# Altium schematic sheet DAC.SchDoc: DACs
size Letter; PageSetup: Record=PageOptions|CenterHorizontal=True|CenterVertical=True|PrintScale=0.75|XCorrection=1.00|YCorrection=1.00|PrintKind=1|BorderSize=5000000|LeftOffset=0|BottomOffset=0|Orientation=2|PaperLength=1000|PaperWidth=1000|Scale=100|PaperSource=7|PrintQuality=-4|MediaType=1|DitherType=10|PaperKind=Letter|PrintScaleMode=1; Author: Adam Gilbert; CompanyName: McGill University; DrawnBy: Adam Gilbert; Organization: Altium Limited; Address1: McGill Cosmology; Address2: 3600 University Street; Address3: Montreal, Quebec; Address4: Canada; Revision: Rev0; ProjectName: Dan DfMux Mezz
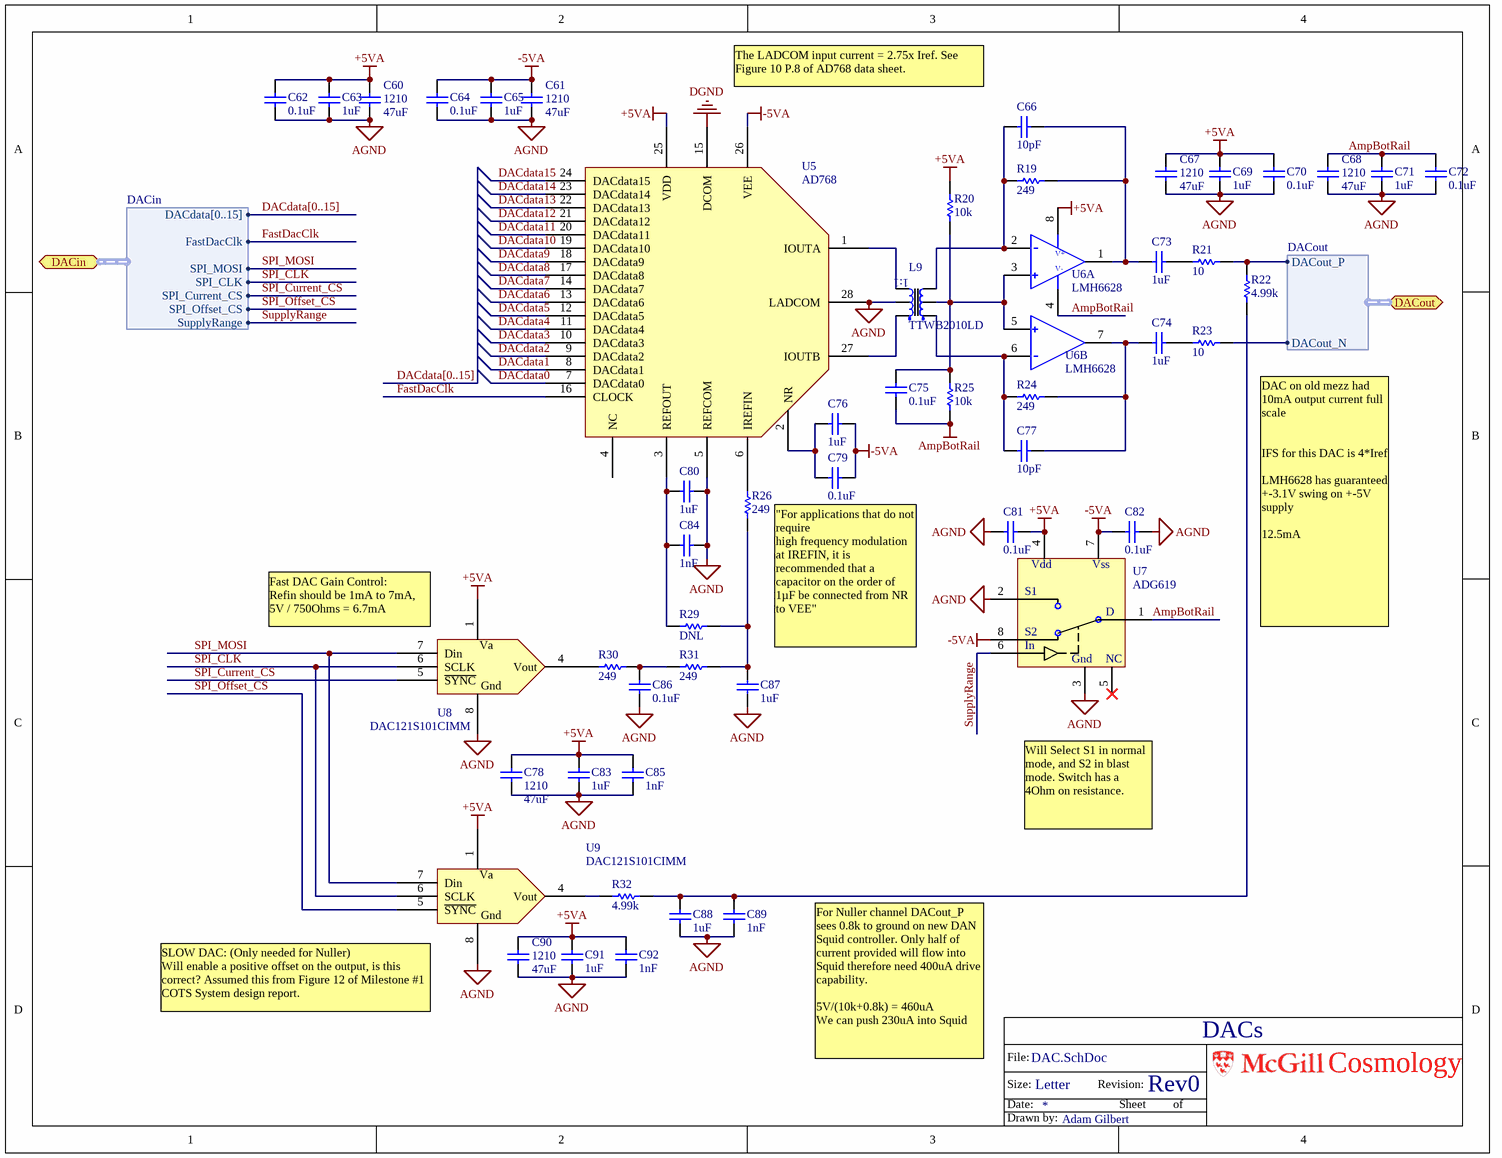
[diagram p0: DAC.SchDoc]

## Parts
C60  Footprint: 1210  [CC3225-1210]  (hidden comment: 47uF)
C61  Footprint: 1210  [CC3225-1210]  (hidden comment: 47uF)
C62  0.1uF  [0603]
C63  1uF  [0603]
C64  0.1uF  [0603]
C65  1uF  [0603]
C66  10pF  [0603]
C67  Footprint: 1210  [CC3225-1210]  (hidden comment: 47uF)
C68  Footprint: 1210  [CC3225-1210]  (hidden comment: 47uF)
C69  1uF  [0603]
C70  0.1uF  [0603]
C71  1uF  [0603]
C72  0.1uF  [0603]
C73  1uF  [0603]
C74  1uF  [0603]
C75  0.1uF  [0603]
C76  1uF  [0603]
C77  10pF  [0603]
C78  Footprint: 1210  [CC3225-1210]  (hidden comment: 47uF)
C79  0.1uF  [0603]
C80  1uF  [0603]
C81  0.1uF  [0603]
C82  0.1uF  [0603]
C83  1uF  [0603]
C84  1nF  [0603]
C85  1nF  [0603]
C86  0.1uF  [0603]
C87  1uF  [0603]
C88  1uF  [0603]
C89  1nF  [0603]
C90  Footprint: 1210  [CC3225-1210]  (hidden comment: 47uF)
C91  1uF  [0603]
C92  1nF  [0603]
L9  TTWB2010LD  [TTWB]
R19  249  [0603]
R20  10k  [0603]
R21  10  [0603]
R22  4.99k  [0603]
R23  10  [0603]
R24  249  [0603]
R25  10k  [0603]
R26  249  [0603]
R29  DNL  [0603]
R30  249  [0603]
R31  249  [0603]
R32  4.99k  [0603]
U5  AD768  [SOIC 28 300mils]
U6  LMH6628  [SO8]  (parts A,B of 2)
U7  ADG619  [SOT23-8]
U8  DAC121S101CIMM  [MSOP-8]
U9  DAC121S101CIMM  [MSOP-8]

## Ports
DACin (harness DACin), DACout (harness DACout)

## Harnesses
DACin: DACdata[0..15], FastDacClk, SPI_MOSI, SPI_CLK, SPI_Current_CS, SPI_Offset_CS, SupplyRange
DACout: DACout_P, DACout_N

## Nets
+5VA: C60.2 C62.2 C63.2 C67.2 C69.1 C70.1 C78.1 C81.1 C83.1 C85.1 C90.2 C91.2 C92.2 R20.2 U5.25(VDD) U6.8(V+) U7.4(Vdd) U8.1(Va) U9.1(Va)
-5VA: C61.2 C64.2 C65.2 C76.1 C79.1 C82.2 U5.26(VEE) U7.7(Vss) U7.8(S2)
AGND: C60.1 C61.1 C62.1 C63.1 C64.1 C65.1 C67.1 C68.1 C69.2 C70.2 C71.2 C72.2 C78.2 C80.2 C81.2 C82.1 C83.2 C84.2 C85.2 C86.2 C87.2 C88.1 C89.1 C90.1 C91.1 C92.1 L9.2(PrimCent) U5.5(REFCOM) U5.28(LADCOM) U7.2(S1) U7.3(Gnd) U8.8(Gnd) U9.8(Gnd)
AmpBotRail: C68.2 C71.1 C72.1 C75.2 R25.1 U6.4(V-) U7.1(D)
DGND: U5.15(DCOM)
DACdata0: U5.7(DACdata0)
DACdata1: U5.8(DACdata1)
DACdata2: U5.9(DACdata2)
DACdata3: U5.10(DACdata3)
DACdata4: U5.11(DACdata4)
DACdata5: U5.12(DACdata5)
DACdata6: U5.13(DACdata6)
DACdata7: U5.14(DACdata7)
DACdata8: U5.17(DACdata8)
DACdata9: U5.18(DACdata9)
DACdata10: U5.19(DACdata10)
DACdata11: U5.20(DACdata11)
DACdata12: U5.21(DACdata12)
DACdata13: U5.22(DACdata13)
DACdata14: U5.23(DACdata14)
DACdata15: U5.24(DACdata15)
FastDacClk: U5.16(CLOCK) ; port DACin.FastDacClk
SPI_CLK: U8.6(SCLK) U9.6(SCLK) ; port DACin.SPI_CLK
SPI_Current_CS: U8.5(~{SYNC}) ; port DACin.SPI_Current_CS
SPI_MOSI: U8.7(Din) U9.7(Din) ; port DACin.SPI_MOSI
SPI_Offset_CS: U9.5(~{SYNC}) ; port DACin.SPI_Offset_CS
SupplyRange: U7.6(In) ; port DACin.SupplyRange
NetC66_1: C66.1 L9.4(Sec) R19.1 U6.2(IN-)
NetC66_2: C66.2 C73.2 R19.2 U6.1(Out)
NetC73_1: C73.1 R21.1
NetC74_1: C74.1 R23.1
NetC74_2: C74.2 C77.2 R24.2 U6.7(Out)
NetC75_1: C75.1 L9.5(SecCent) R20.1 R25.2 U6.3(IN+) U6.5(IN+)
NetC76_2: C76.2 C79.2 U5.2(NR)
NetC77_1: C77.1 L9.6(SecDot) R24.1 U6.6(IN-)
NetC80_1: C80.1 C84.1 R29.1 U5.3(REFOUT)
NetC86_1: C86.1 R30.1 R31.2
NetC87_1: C87.1 R26.2 R29.2 R31.1
NetC88_2: C88.2 C89.2 R22.1 R32.1
NetL9_1: L9.1(PrimDot) U5.27(IOUTB)
NetL9_3: L9.3(Prim) U5.1(IOUTA)
NetR21_2: R21.2 R22.2 ; port DACout.DACout_P
NetR23_2: R23.2 ; port DACout.DACout_N
NetR26_1: R26.1 U5.6(IREFIN)
NetR30_2: R30.2 U8.4(Vout)
NetR32_2: R32.2 U9.4(Vout)

Not connected (* = marked no-connect by the designer): U5 4(NC); U7 5(NC)*; U8 2(NC) 3(NC); U9 2(NC) 3(NC)

## Buses and harness runs
bus DACdata[0..15]

## Notes on the sheet
- The LADCOM input current = 2.75x Iref. See Figure 10 P.8 of AD768 data sheet.
- (near U8) Fast DAC Gain Control:
  Refin should be 1mA to 7mA, 5V / 750Ohms = 6.7mA
- "For applications that do not require
  high frequency modulation at IREFIN, it is recommended that a capacitor on the order of 1µF be connected from NR to VEE"
- DAC on old mezz had 10mA output current full scale
  IFS for this DAC is 4*Iref
  LMH6628 has guaranteed  +-3.1V swing on +-5V supply
  12.5mA
- Will Select S1 in normal mode, and S2 in blast mode. Switch has a 4Ohm on resistance.
- (near U9) SLOW DAC: (Only needed for Nuller)
  Will enable a positive offset on the output, is this correct? Assumed this from Figure 12 of Milestone #1 COTS System design report.
- For Nuller channel DACout_P sees 0.8k to ground on new DAN Squid controller. Only half of current provided will flow into Squid therefore need 400uA drive capability.
  5V/(10k+0.8k) = 460uA
  We can push 230uA into Squid
- File:
- Size:
- Date:
- Letter
- Revision:
- Sheet
- of
- Cosmology
- Drawn by:
- (in symbol TTWB2010LD) 1:1

## Library data of the parts
C60 C61 C67 C68 C78 C90 = CAP 1210: Capacitor, Ceramic, 1210; Manufacturer: Taiyo Yuden; Part Constraints: 1210 10V X7R; Manufacturers Part Number: LMK325B7476MM; Value: 47uF; Type: Capacitor; SupplierUnitCost: $0.54
C62-C66 C69-C77 C79-C89 C91 C92 = CAP 0603: Capacitor, Ceramic, 0603; Part Constraints: 10% 16V X7R 0603; Manufacturer: Generic; Manufacturers Part Number: Generic; Type: Capacitor; SupplierUnitCost: 0
  C62 C64 C70 C72 C75 C79 C81 C82 C86: Value: 0.1uF
  C63 C65 C69 C71 C73 C74 C76 C80 C83 C87 C88 C91: Value: 1uF
  C66 C77: Value: 10pF
  C84 C85 C89 C92: Value: 1nF
L9 = TTWB2010LD: Transformer; Manufacturer: Coil Craft; Assembly Comments: none; Manufacturers Part Number: TTWB2010LD; Part Constraints: TTWB2010LD; Supplier 1: Coil Craft; Supplier Part Number 1: TTWB2010LD; SupplierUnitCost: $3.25
R19-R26 R29-R32 = RES 0603: Resistor; Manufacturer: Generic; Part Constraints: 1% 1/10W 100ppm 0603; Manufacturers Part Number: Generic; Type: Resistor; SupplierUnitCost: 0
  R19 R24 R26 R30 R31: Value: 249
  R20 R25: Value: 10k
  R21 R23: Value: 10
  R22 R32: Value: 4.99k
  R29: Value: DNL
U5 = AD768: DAC 16bit 30MSPS; Manufacturers Part Number: AD768ARZ; Manufacturer: Analog Devices; Assembly Comments: none; Part Constraints: AD768ARZ; Supplier 1: Digi-Key; Supplier Part Number 1: AD768ARZ-ND; Type: IC; SupplierUnitCost: $46.27
U6 = LMH6628: Dual Opamp 200Mhz GBP Soic 8; Part Constraints: LMH6628MA/NOPB; Manufacturer: National Semiconductor; Assembly Comments: none; Manufacturers Part Number: LMH6628MA/NOPB; Type: IC; SupplierUnitCost: $4.44; Supplier 1: Digi-Key; Supplier Part Number 1: LMH6628MA-ND
U7 = ADG619: SPDT Switch +-5V 4 Ohm on resistance; Manufacturer: Analog Devices; Manufacturers Part Number: ADG619BRTZ; Assembly Comments: none; Part Constraints: ADG619BRTZ; Type: IC; SupplierUnitCost: $3.05
U8 U9 = DAC121S101CIMM/NOPB: CONV D/A 12BIT MICROPWR 8MSOP; Manufacturer: National Semiconductor; Settling Time: 12µs; Number of Bits: 12; Data Interface: DSP, MICROWIRE™, QSPI™, Serial, SPI™; Number of Converters: 1; Voltage Supply Source: Single Supply; Power Dissipation (Max): 1.72mW; Number of Outputs and Type: 1 Voltage, Unipolar; 1 Voltage, Bipolar; RoHS: RoHS Compliant; Category: Integrated Circuits (ICs); Stock 1: 3011; Pricing 1: 1=3.5, 25=2.8616, 100=2.5698, 250=2.33624, 500=2.0442 (CAD); Operating Temperature: -40°C ~ 105°C; Mounting Type: Surface Mount; Package / Case: 8-TSSOP, 8-MSOP (0.118", 3.00mm Width); Supplier Device Package: 8-MSOP; Packaging: Cut Tape (CT); Sampling Rate (Per Second): *; ComponentLink1URL: http://www.ti.com/lit/ds/symlink/dac121s101.pdf; ComponentLink1Description: http://www.ti.com/lit/ds/symlink/dac121s101.pdf; Supplier 1: Digi-Key; Supplier Part Number 1: DAC121S101CIMMCT-ND; Part Constraints: DAC121S101CIMM/NOPB; Manufacturers Part Number: DAC121S101CIMM/NOPB; Type: IC; SupplierUnitCost: $3.70